# Altium schematic sheet GPIOExpander.SchDoc: Internal GPIO Expander
size 292 x 193 mm; CheckedBy: Łukasz Gójski; Author: Jakub Howors; CompanyName: Politechnika Warszawska; Organization: EITI; Address1: Nowowiejska 15/19; Address2: 00-665 Warszawa; SheetNumber: 7; SheetTotal: 13; HTTPLink: www.pw.edu.pl
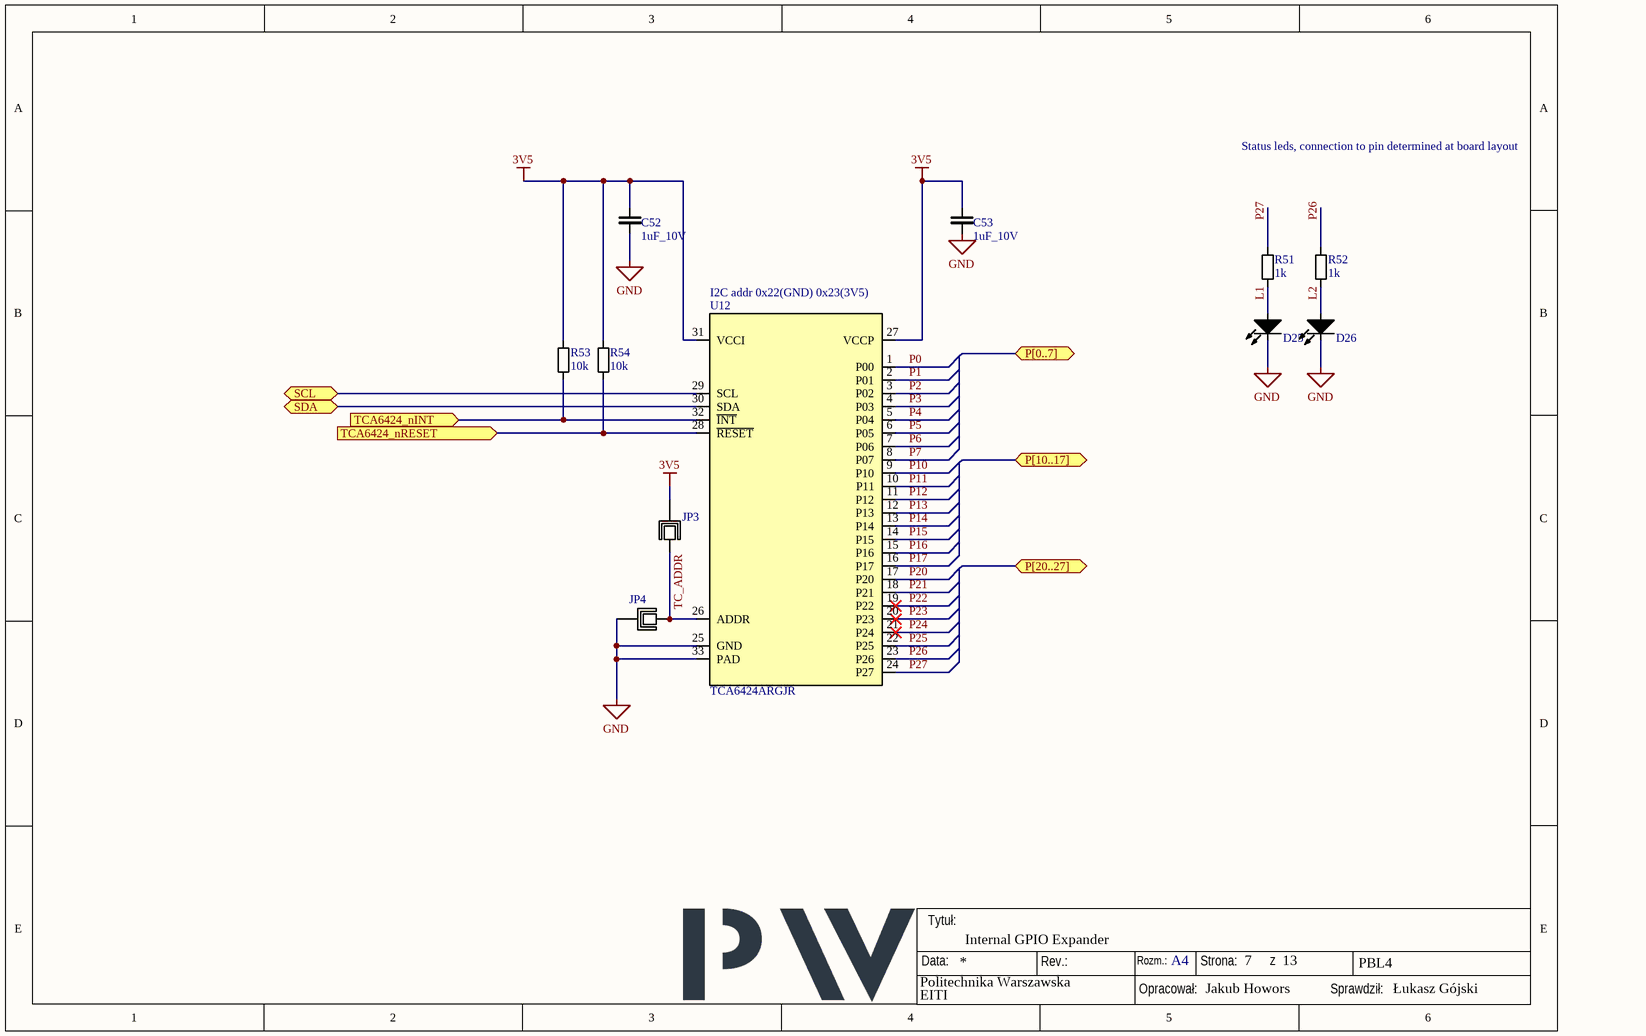
[diagram p0: GPIOExpander.SchDoc]

## Parts
C52  1uF_10V  [C_0603]
C53  1uF_10V  [C_0603]
D25  RED  [LED_0603]  (value not drawn)
D26  RED  [LED_0603]  (value not drawn)
JP3  JUMPER  [Jumper]  (value not drawn)
JP4  JUMPER  [Jumper]  (value not drawn)
R51  1k  [R_0603]
R52  1k  [R_0603]
R53  10k  [R_0603]
R54  10k  [R_0603]
U12  TCA6424ARGJR  [TCA6424A_RGJ0032A]

## Ports
P[0..7] (bidir, see MainAssembly[5D]), P[10..17] (bidir, see MainAssembly[5D]), P[20..27] (bidir, see MainAssembly[6D]), SCL (bidir, see MainAssembly[5D], ADCHighVoltageInputsSchDoc[2A], DAC[3C], DCDCreg[2C], PWMExpander[2B], USBPD[4C]), SDA (bidir, see MainAssembly[5D], ADCHighVoltageInputsSchDoc[2A], DAC[3C], DCDCreg[2C], PWMExpander[2A], USBPD[4C]), TCA6424_nINT (in, see MainAssembly[5D]), TCA6424_nRESET (in, see MainAssembly[5D])

## Nets
3V5: C52.2 C53.2 JP3.2 R53.2 R54.2 U12.27(VCCP) U12.31(VCCI)
GND: C52.1 C53.1 D25.K D26.K JP4.2 U12.25(GND) U12.33(PAD)
L1: D25.A R51.1
L2: D26.A R52.1
P0: U12.1(P00)
P1: U12.2(P01)
P2: U12.3(P02)
P3: U12.4(P03)
P4: U12.5(P04)
P5: U12.6(P05)
P6: U12.7(P06)
P7: U12.8(P07)
P10: U12.9(P10)
P11: U12.10(P11)
P12: U12.11(P12)
P13: U12.12(P13)
P14: U12.13(P14)
P15: U12.14(P15)
P16: U12.15(P16)
P17: U12.16(P17)
P20: U12.17(P20)
P21: U12.18(P21)
P22: U12.19(P22)
P23: U12.20(P23)
P24: U12.21(P24)
P25: U12.22(P25)
P26: R52.2 U12.23(P26)
P27: R51.2 U12.24(P27)
SCL: U12.29(SCL) ; port SCL
SDA: U12.30(SDA) ; port SDA
TC_ADDR: JP3.1 JP4.1 U12.26(ADDR)
TCA6424_nINT: R53.1 U12.32(~{INT}) ; port TCA6424_nINT
TCA6424_nRESET: R54.1 U12.28(~{RESET}) ; port TCA6424_nRESET

## Notes on the sheet
- Status leds, connection to pin determined at board layout
- (near U12) I2C addr 0x22(GND) 0x23(3V5)
- Data:
- Tytuł:
- Rev.:
- Rozm.:
- A4
- Strona:
- z
- PBL4
- Opracował:
- Sprawdził:

## Library data of the parts
C52 C53 = C_1uF_10V: Ceramic capacitor; Value: 1u; Voltage: 10V; Casing: 0603; Dielectric: X7R; Tolerance: 10%; Technology: Ceramic
D25 D26 = LED_0603: LED RED 0603 3.3V; Casing: 0603; Color: RED
JP3 JP4 = Jumper x2: Jumper on traces
R51 R52 = R_1k: Resistor; Tolerance: 1%; Power: 100mW; Casing: 0603; Value: 1k
R53 R54 = R_10k: Resistor; Tolerance: 1%; Power: 100mW; Casing: 0603; Value: 10k
U12 = IC_tca6424a_TCA6424ARGJR: 24-bit translating 1.65- to 5.5-V I2C/SMBus I/O expander with interrupt, reset & config registers 32-UQFN -40 to 85; Manufacturer: Texas Instruments; Manufacturer_Part_Number: TCA6424ARGJR; PartNumber: TCA6424ARGJR; PackageReference: RGJ0032A